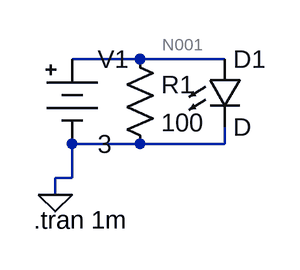
[diagram p0: schematic D-34_MISC-1_v-1-0_e-1.asc]
D-34_MISC-1_v-1-0_e-1.asc, the LTspice schematic file:
Version 4
SHEET 1 880 680
WIRE 160 64 96 64
WIRE 240 64 160 64
WIRE 160 144 96 144
WIRE 240 144 240 128
WIRE 240 144 160 144
WIRE 96 176 96 144
WIRE 96 176 80 176
WIRE 80 192 80 176
FLAG 80 192 0
SYMBOL LED 224 64 R0
SYMATTR InstName D1
SYMBOL res 144 48 R0
SYMATTR InstName R1
SYMATTR Value 100
SYMBOL Misc\\battery 96 48 R0
SYMATTR InstName V1
SYMATTR Value 3
TEXT 60 216 Left 2 !.tran 1m

The netlist it stands for:
* D-34_MISC-1_v-1-0_e-1.asc
D1 N001 0 D
R1 N001 0 100
V1 N001 0 3
.model D D
.lib standard.dio
.tran 1m
.backanno
.end

* Results of the author's LTspice run, read from the files saved beside the schematic
* Operating Point, zero values left out:
*   V(n001) = 3 V
*   I(D1) = 1.572 TA
*   I(R1) = 30 mA
*   I(V1) = -1.572 TA